# EAGLE design Template (EAGLE 5.00)
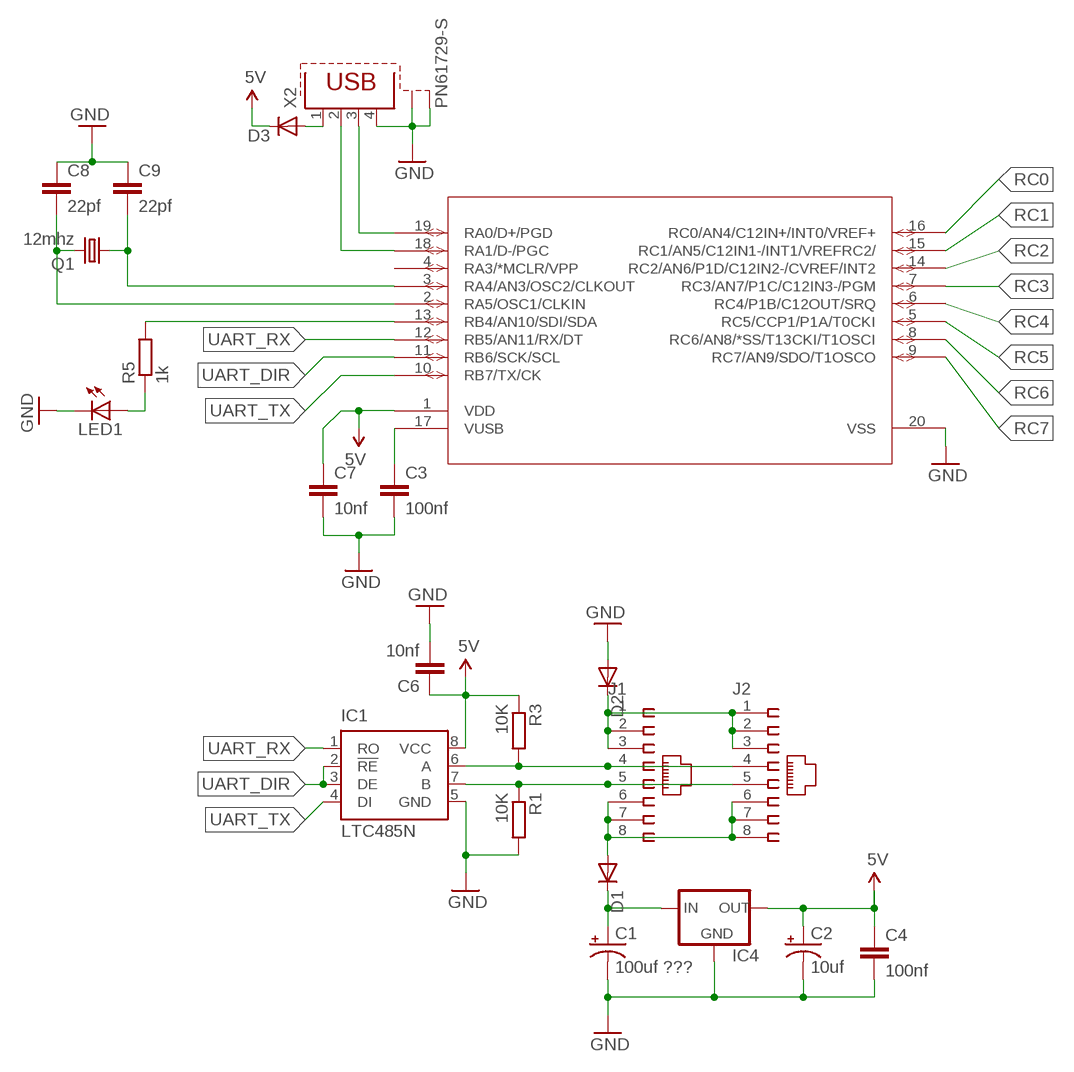
[diagram p0: schematic, sheet 1]

## Parts
C1  100uf ???  CAP_POLPTH1  [CPOL-RADIAL-100UF-25V]
C2  10uf  CAP_POLPTH1  [CPOL-RADIAL-100UF-25V]
C3  100nf  C5/2.5  [C5B2.5]
C4  100nf  C5/2.5  [C5B2.5]
C6  10nf  C5/2.5  [C5B2.5]
C7  10nf  C5/2.5  [C5B2.5]
C8  22pf  C5/2.5  [C5B2.5]
C9  22pf  C5/2.5  [C5B2.5]
D1  DIODE-D-7.5  [D-7.5]
D2  DIODE-D-7.5  [D-7.5]
D3  DIODE-D-7.5  [D-7.5]
IC1  LTC485N  [DIL08]
IC4  78XXL  [78XXL]
J1  215877-4  [215877-4]
J2  215877-4  [215877-4]
LED1  LED5MM  [LED5MM]
Q1  12mhz  CRYSTALHC49U-V  [HC49U-V]
R1  10K  R-EU_0204/5  [0204/5]
R3  10K  R-EU_0204/5  [0204/5]
R5  1k  R-EU_0207/7  [0207/7]
U$2  PIC18F14K50-E-P  [PIC18F14K50-E/P]
X2  PN61729-S  [PN61729-S]

## Nets
5V: C2.1(+) C4.1 C6.1 C7.1 D3.C IC1.8(VCC) IC4.OUT R3.1 U$2.1(VDD)
GND: C1.2(-) C2.2(-) C3.2 C4.2 C6.2 C7.2 C8.1 C9.1 D2.A IC1.5(GND) IC4.GND LED1.K(C) R1.2 U$2.20(VSS) X2.4 X2.S1 X2.S2
N$1: LED1.A R5.1
N$2: D1.A J1.6 J1.7 J1.8 J2.6 J2.7 J2.8
N$3: IC1.6(A) J1.4 J2.4 R3.2
N$4: R5.2 U$2.13(RB4/AN10/SDI/SDA)
N$5: C1.1(+) D1.C IC4.IN
N$9: D2.C J1.1 J1.2 J1.3 J2.1 J2.2 J2.3
N$11: C3.1 U$2.17(VUSB)
N$13: U$2.19(RA0/D+/PGD) X2.3
N$14: U$2.18(RA1/D-/PGC) X2.2
N$15: D3.A X2.1
N$50: IC1.7(B) J1.5 J2.5 R1.1
N$52: C8.2 Q1.2 U$2.2(RA5/OSC1/CLKIN)
N$53: C9.2 Q1.1 U$2.3(RA4/AN3/OSC2/CLKOUT)
RC0: U$2.16(RC0/AN4/C12IN+/INT0/VREF+)
RC1: U$2.15(RC1/AN5/C12IN1-/INT1/VREFRC2/)
RC2: U$2.14(RC2/AN6/P1D/C12IN2-/CVREF/INT2)
RC3: U$2.7(RC3/AN7/P1C/C12IN3-/PGM)
RC4: U$2.6(RC4/P1B/C12OUT/SRQ)
RC5: U$2.5(RC5/CCP1/P1A/T0CKI)
RC6: U$2.8(RC6/AN8/*SS/T13CKI/T1OSCI)
RC7: U$2.9(RC7/AN9/SDO/T1OSCO)
UART_DIR: IC1.2(!RE) IC1.3(DE) U$2.11(RB6/SCK/SCL)
UART_RX: IC1.1(RO) U$2.12(RB5/AN11/RX/DT)
UART_TX: IC1.4(DI) U$2.10(RB7/TX/CK)
Unconnected: U$2.4(RA3/*MCLR/VPP)

## Library data of the parts
C1 C2 = SparkFun:CAP_POL: Capacitor Polarized These are standard SMD and PTH capacitors. Normally 10uF, 47uF, and 100uF in electrolytic and tantalum varieties. Always verify the external diameter of the through hole cap, it varies with capacity, voltage, and manufacturer. The EIA devices should be standard.
C3 C4 C6-C9 = capacitor-wima:C: CAPACITOR naming: grid - package width
D1-D3 = diode:DIODE-: DIODE
IC1 = linear-technology:LTC485: Low Power RS485 Interface Transceiver Source: http://www.linear.com/pc/downloadDocument.do?navId=H0,C1,C1007,C1017,P2064,D1718
IC4 = v-reg:78XXL: VOLTAGE REGULATOR
J1 J2 = con-amp:215877-4: AMP connector
LED1 = led:LED: LED OSRAM: - CHIPLED LG R971, LG N971, LY N971, LG Q971, LY Q971, LO R971, LY R971 LH N974, LH R974 LS Q976, LO Q976, LY Q976 LO Q996 - Hyper CHIPLED LW Q18S LB Q993, LB Q99A, LB R99A - SideLED LS A670, LO A670, LY A670, LG A670, LP A670 LB A673, LV A673, LT A673, LW A673 LH A674 LY A675 LS A676, LA A676, LO A676, LY A676, LW A676 LS A679, LY A679, LG A679 - Hyper Micro SIDELED® LS Y876, LA Y876, LO Y876, LY Y876 LT Y87S - SmartLED LW L88C, LW L88S LB L89C, LB L89S, LG L890 LS L89K, LO L89K, LY L89K LS L896, LA L896, LO L896, LY L896 - TOPLED LS T670, LO T670, LY T670, LG T670, LP T670 LSG T670, LSP T670, LSY T670, LOP T670, LYG T670 LG T671, LOG T671, LSG T671 LB T673, LV T673, LT T673, LW T673 LH T674 LS T676, LA T676, LO T676, LY T676, LB T676, LH T676, LSB T676, LW T676 LB T67C, LV T67C, LT T67C, LS T67K, LO T67K, LY T67K, LW E67C LS E67B, LA E67B, LO E67B, LY E67B, LB E67C, LV E67C, LT E67C LW T67C LS T679, LY T679, LG T679 LS T770, LO T770, LY T770, LG T770, LP T770 LB T773, LV T773, LT T773, LW T773 LH T774 LS E675, LA E675, LY E675, LS T675 LS T776, LA T776, LO T776, LY T776, LB T776 LHGB T686 LT T68C, LB T68C - Hyper Mini TOPLED® LB M676 - Mini TOPLED Santana® LG M470 LS M47K, LO M47K, LY M47K Source: http://www.osram.convergy.de LUXEON: - LUMILED® LXK2-PW12-R00, LXK2-PW12-S00, LXK2-PW14-U00, LXK2-PW14-V00 LXK2-PM12-R00, LXK2-PM12-S00, LXK2-PM14-U00 LXK2-PE12-Q00, LXK2-PE12-R00, LXK2-PE12-S00, LXK2-PE14-T00, LXK2-PE14-U00 LXK2-PB12-K00, LXK2-PB12-L00, LXK2-PB12-M00, LXK2-PB14-N00, LXK2-PB14-P00, LXK2-PB14-Q00 LXK2-PR12-L00, LXK2-PR12-M00, LXK2-PR14-Q00, LXK2-PR14-R00 LXK2-PD12-Q00, LXK2-PD12-R00, LXK2-PD12-S00 LXK2-PH12-R00, LXK2-PH12-S00 LXK2-PL12-P00, LXK2-PL12-Q00, LXK2-PL12-R00 Source: www.luxeon.com KINGBRIGHT: KA-3528ASYC Source: www.kingbright.com
Q1 = crystal:CRYSTAL: CRYSTAL
R1 R3 = resistor:R-EU_: RESISTOR, European symbol
R5 = rcl:R-EU_: RESISTOR, European symbol
U$2 = pic18f14k50:PIC18F14K50-E-P
X2 = con-berg:PN61729-S: BERG USB connector

## Board
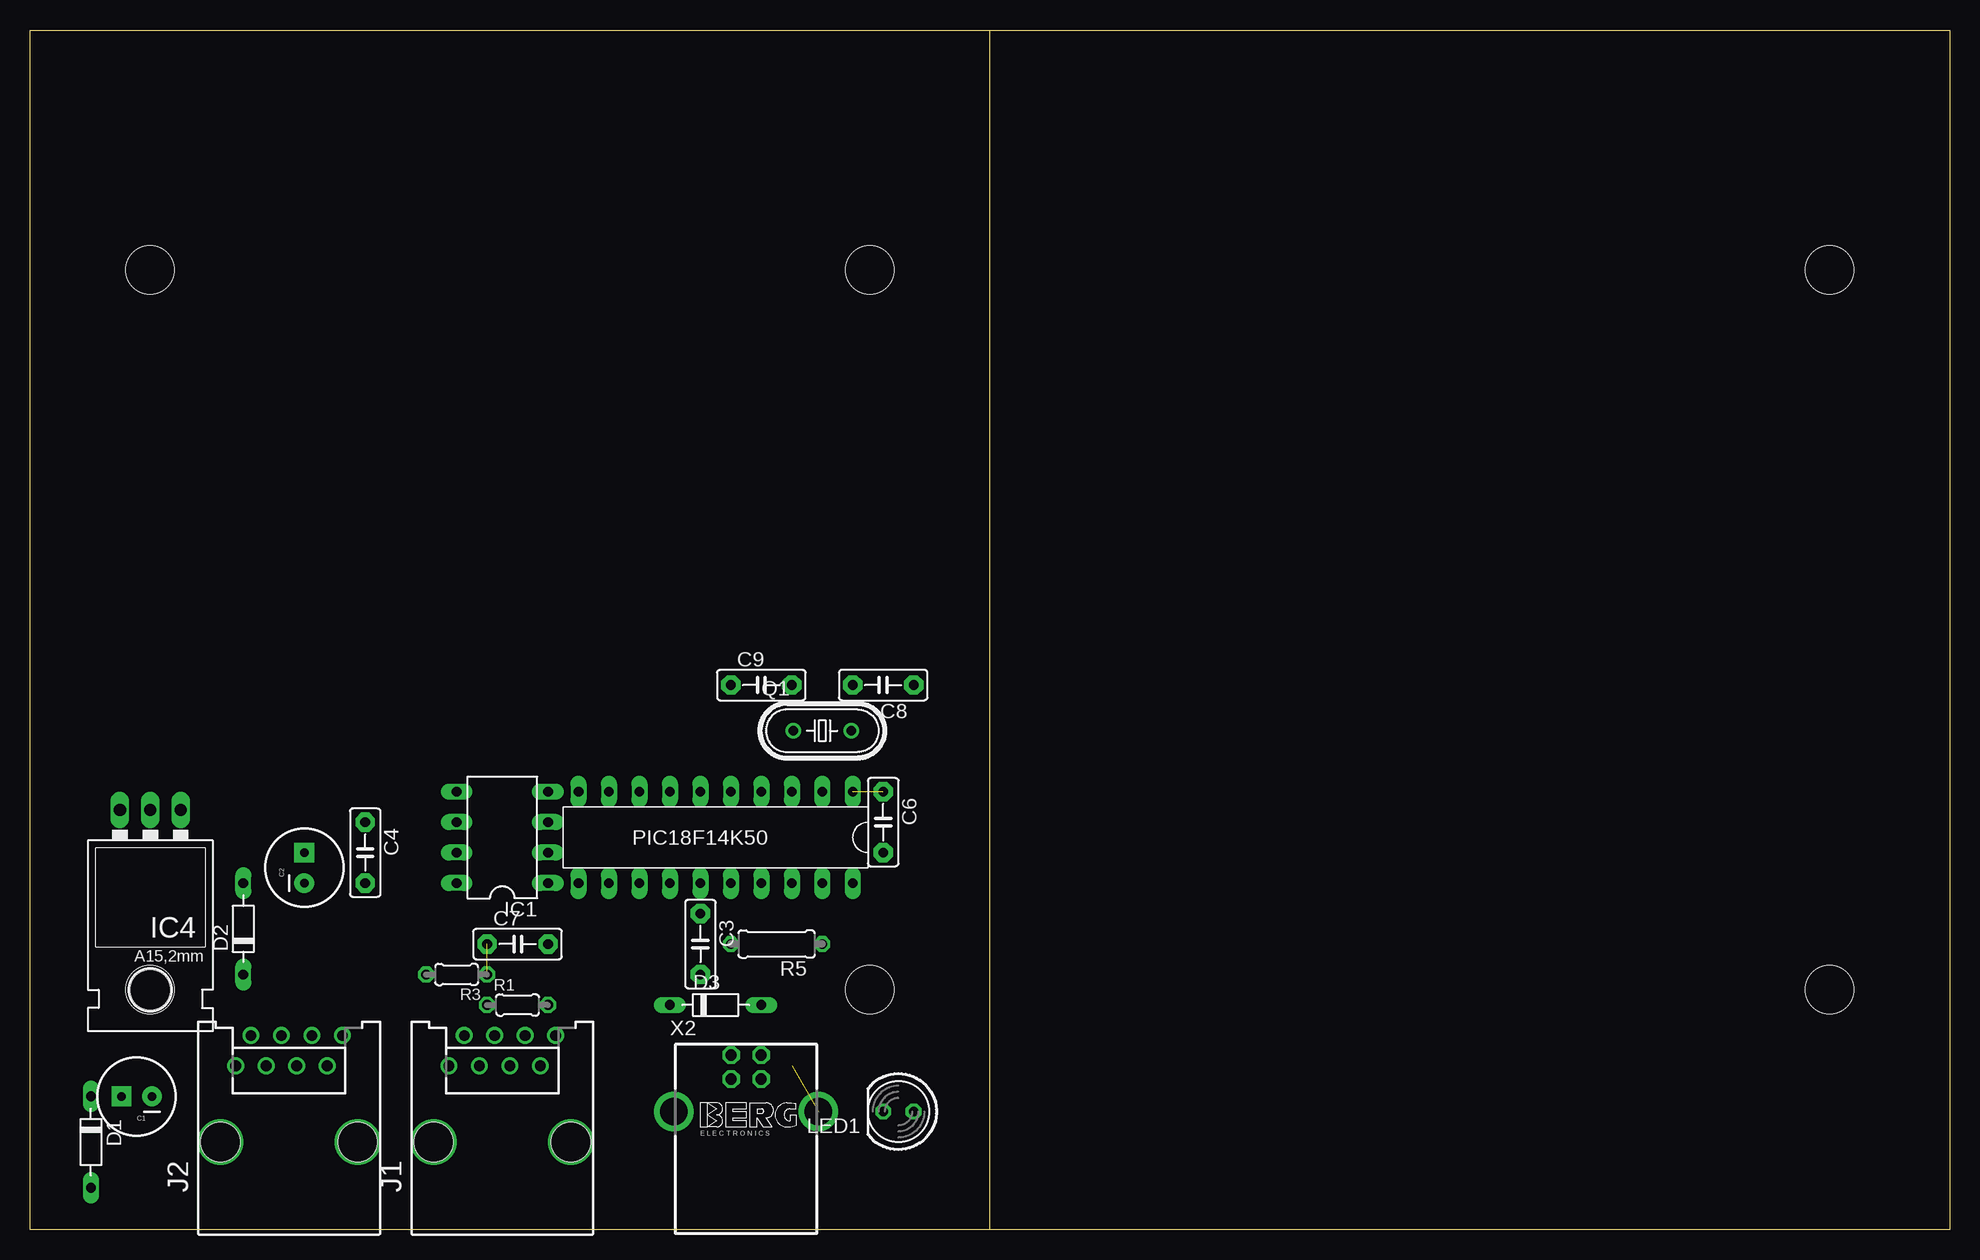
[diagram p1: board, top side]
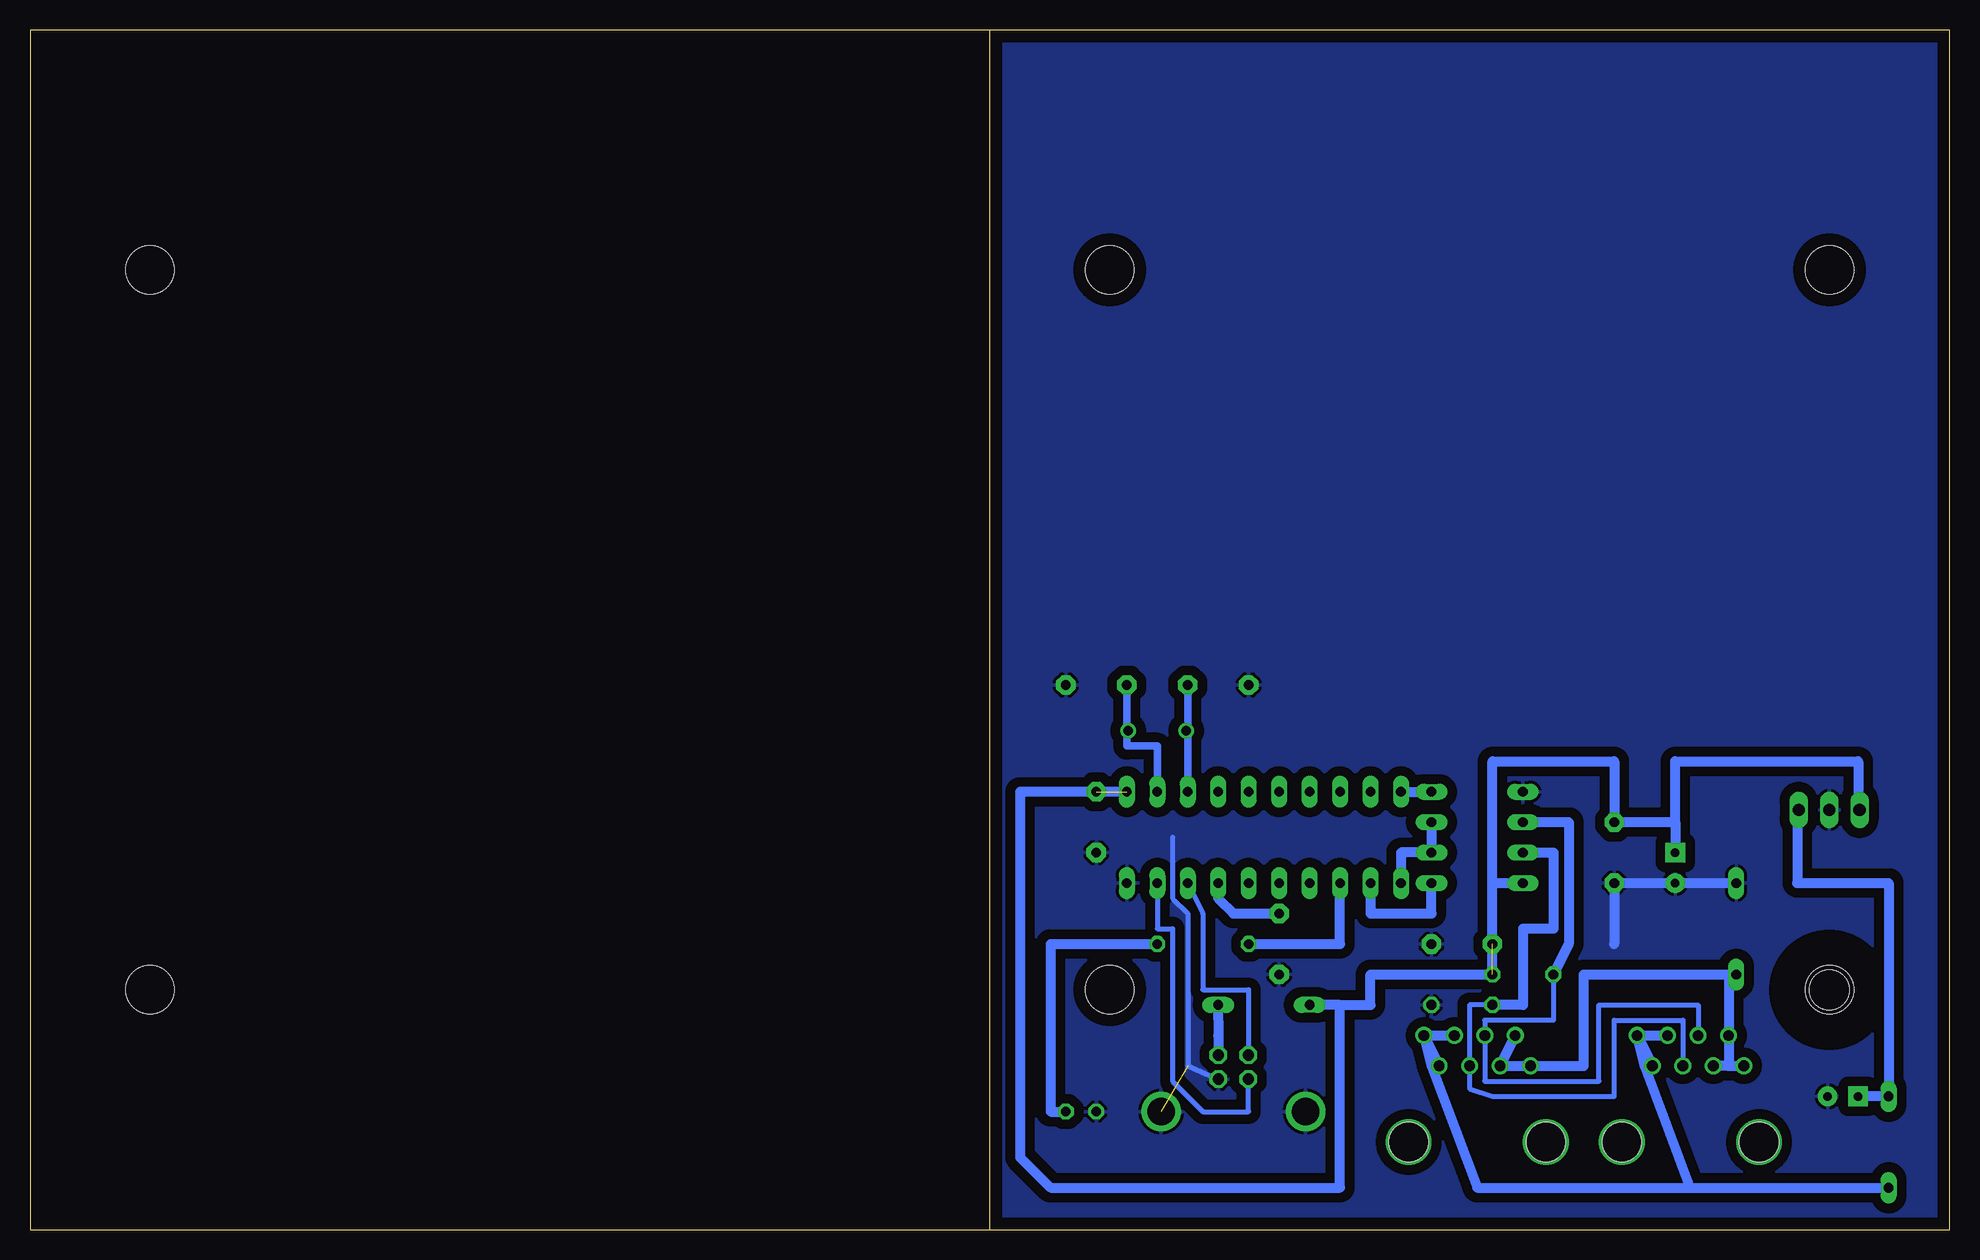
[diagram p2: board, bottom side, seen from below]

Size 160 x 100 mm. Coordinates in mm from the lower left corner, seen from the top.
Outline: 80,100 0,100 0,0 81.26,0
Outline: 80,100 160,100 160,0 81.26,0
Outline: 81.26,0 80,0 80,100
Copper layers (1*16): Top 0.035mm / dielectric 1.5mm / Bottom 0.035mm
Design rules "default": minimum track width 10mil, minimum drill 24mil, track to track 8mil, track to pad 8mil, pad to pad 8mil, via to via 8mil, smd to smd 8mil, copper to edge 40mil, drill to drill 8mil, minimum pad ring 10mil, minimum via ring 8mil, stop-mask expansion 4mil, vias tented up to drill 0mil, thermal gap 10mil
Holes 4 mm at 10,80 10,20 70,20 70,80 150,80 150,20

### Footprints (pad centres in the part's own frame; a part is rotated, then mirrored left to right if it is on the bottom)
CPOL-RADIAL-100UF-25V = drill 0.7 pad 1.651 square: 1 1.27,0 | drill 0.7 pad 1.651 round: 2 -1.27,0
C5B2.5 = drill 0.813 pad 1.6 octagon: 1 -2.54,0; 2 2.54,0
D-7.5 = drill 0.813 long: A 3.81,0; C -3.81,0
DIL08 = drill 0.813 long: 1 -3.81,-3.81; 2 -1.27,-3.81; 3 1.27,-3.81; 4 3.81,-3.81; 5 3.81,3.81; 6 1.27,3.81; 7 -1.27,3.81; 8 -3.81,3.81
78XXL = drill 1.016 long: GND 0,-3.81; IN -2.54,-3.81; OUT 2.54,-3.81 | hole 3.302: 0,11.176
215877-4 = drill 0.889 round: 1 -4.445,6.35; 2 -3.175,8.89; 3 -1.905,6.35; 4 -0.635,8.89; 5 0.635,6.35; 6 1.905,8.89; 7 3.175,6.35; 8 4.445,8.89 | hole 3.251: -5.715,0; 5.715,0
LED5MM = drill 0.813 octagon: A -1.27,0; K 1.27,0
HC49U-V = drill 0.813 round: 1 -2.413,0; 2 2.413,0
0204/5 = drill 0.813 octagon: 1 -2.54,0; 2 2.54,0
0207/7 = drill 0.813 octagon: 1 -3.81,0; 2 3.81,0
PIC18F14K50-E/P = drill 0.813 long: 1 -5.08,12.7; 2 -5.08,10.16; 3 -5.08,7.62; 4 -5.08,5.08; 5 -5.08,2.54; 6 -5.08,0; 7 -5.08,-2.54; 8 -5.08,-5.08; 9 -5.08,-7.62; 10 -5.08,-10.16; 11 2.54,-10.16; 12 2.54,-7.62; 13 2.54,-5.08; 14 2.54,-2.54; 15 2.54,0; 16 2.54,2.54; 17 2.54,5.08; 18 2.54,7.62; 19 2.54,10.16; 20 2.54,12.7
PN61729-S = drill 0.95 octagon: 1 1.25,4.71; 2 -1.25,4.71; 3 -1.25,2.71; 4 1.25,2.71 | drill 2.3 pad 2.9 round: S1 -6.02,0; S2 6.02,0

### Placement (x,y rotation side)
C1  470uf 25v  [CPOL-RADIAL-100UF-25V]  8.89,11.1 180 top
C2  22.86,30.15 90 top
C3  55.88,23.8 270 top
C4  27.94,31.42 270 top
C6  71.12,33.96 270 top
C7  40.64,23.8 0 top
C8  71.12,45.39 180 top
C9  60.96,45.39 0 top
D1  1N4007  [D-7.5]  5.08,7.29 270 top
D2  1N4007  [D-7.5]  17.78,25.07 90 top
D3  1N4007  [D-7.5]  57.15,18.72 0 top
IC1  39.37,32.69 90 top
IC4  10.03,31.17 180 top
J1  39.37,7.29 0 top
J2  21.59,7.29 0 top
LED1  Red  [LED5MM]  72.39,9.83 180 top
Q1  66.04,41.58 0 top
R1  40.64,18.72 0 top
R3  35.56,21.26 180 top
R5  470  [0207/7]  62.23,23.8 180 top
U$2  55.88,31.42 270 top
X2  59.69,9.83 0 top

### Tracks (layer width: path | path; a pad name or v marks a point on that pad's centre or on a via)
5V  (2 unrouted)
  Bottom 0.813: 22.86,33.96 C4.1 27.94,39.04 38.1,39.04 38.1,28.88 | 22.86,33.96 C2.1 | 38.1,28.88 IC1.8 | 38.1,28.88 R3.1 48.26,21.26 48.26,18.72 50.8,18.72 | 50.8,18.72 D3.C | U$2.1 77.47,36.5 77.47,6.02 74.93,3.48 50.8,3.48 50.8,18.72 | IC4.OUT 7.62,34.98 7.62,39.04 22.86,39.04 22.86,33.96
GND  (1 unrouted)
  Bottom 0.406: X2.4 63.5,13.64 63.5,26.34 64.77,27.61 64.77,32.69
  Bottom 0.813: 27.94,23.8 C4.2 C2.2 D2.A
  pour Bottom (isolate 0.813): 0,-1.6 80.01,-1.6 80.01,101.27 0,101.27
N$1
  Bottom 0.813: R5.1 74.93,23.8 74.93,9.83 LED1.A
N$2
  Bottom 0.813: J1.8 J1.7 | J1.8 J1.6 | J2.8 J2.6 | J2.8 J2.7 | 21.59,3.48 D1.A | 21.59,3.48 39.37,3.48 43.18,13.64 J1.8 | 21.59,3.48 25.4,13.64 J2.8
N$3
  Bottom 0.406: R3.2 33.02,17.45 38.73,17.45 J1.4 38.73,12.37 29.21,12.37 29.21,18.72 20.95,18.72 J2.4
  Bottom 0.813: IC1.6 31.75,33.96 31.75,23.8 R3.2
N$4
  Bottom 0.813: U$2.13 50.8,23.8 R5.2
N$5
  Bottom 0.813: C1.1 D1.C 5.08,28.88 12.7,28.88 12.7,34.98 IC4.IN
N$6  (via drill 2.8)
  other vias: 45.09,7.29
N$7  (via drill 2.8)
  other vias: 33.66,7.29
N$8  (via drill 2.8)
  other vias: 27.3,7.29
N$9
  Bottom 0.813: 18.41,13.64 J2.2 18.41,21.26 D2.C 30.48,21.26 30.48,13.64 J1.1 J1.3 J1.2 | 18.41,13.64 J2.1 | 18.41,13.64 J2.3
N$10  (via drill 2.8)
  other vias: 15.88,7.29
N$11
  Bottom 0.813: U$2.17 60.96,27.61 59.69,26.34 C3.1
N$13
  Bottom 0.406: U$2.19 66.04,25.07 64.77,25.07 64.77,12.37 62.23,9.83 58.42,9.83 58.42,12.37 X2.3
N$14
  Bottom 0.406: U$2.18 62.23,26.34 62.23,19.99 58.42,19.99 58.42,14.91 X2.2
N$15
  Bottom 0.813: X2.1 60.94,16.16 D3.A
N$50
  Bottom 0.406: R1.1 40.01,18.72 J1.5 40.01,11.73 38.1,11.1 27.94,11.1 27.94,17.45 22.23,17.45 J2.5
  Bottom 0.813: IC1.7 33.02,31.42 33.02,25.07 35.56,25.07 35.56,18.72 R1.1
N$52
  Bottom 0.61: U$2.2 66.04,40.31 68.58,40.31 68.58,41.58 | 68.58,41.58 Q1.2 | 68.58,41.58 C8.2
N$53
  Bottom 0.61: U$2.3 63.5,41.58 | 63.5,41.58 Q1.1 | 63.5,41.58 C9.2
UART_DIR
  Bottom 0.813: U$2.11 45.72,31.42 IC1.2 IC1.3
UART_RX
  Bottom 0.813: IC1.1 43.18,26.34 48.26,26.34 U$2.12
UART_TX
  Bottom 0.813: U$2.10 IC1.4